# EAGLE design SOIC+TSSOP-20 300mil DIP (EAGLE 6.6.0)
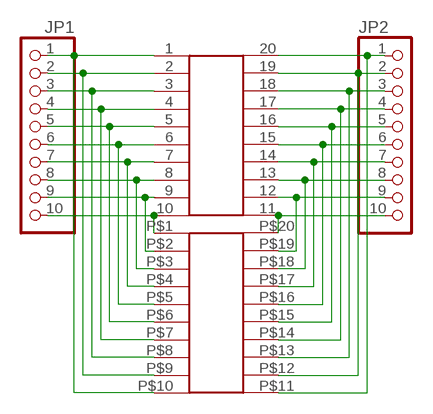
[diagram p0: schematic, sheet 1]

## Parts
JP1  PINHD-1X10  [1X10]
JP2  PINHD-1X10  [1X10]
U$1  SMD-20TSSOP  [TSSOP-20NM]
U$2  SMD-20SOIC  [SO-20NMW]

## Nets
N$1: JP1.1 U$1.1 U$2.P$10
N$2: JP1.2 U$1.2 U$2.P$9
N$3: JP1.3 U$1.3 U$2.P$8
N$4: JP1.4 U$1.4 U$2.P$7
N$5: JP1.5 U$1.5 U$2.P$6
N$6: JP1.6 U$1.6 U$2.P$5
N$7: JP1.7 U$1.7 U$2.P$4
N$8: JP1.8 U$1.8 U$2.P$3
N$9: JP1.9 U$1.9 U$2.P$2
N$10: JP1.10 U$1.10 U$2.P$1
N$11: JP2.1 U$1.20 U$2.P$11
N$12: JP2.2 U$1.19 U$2.P$12
N$13: JP2.3 U$1.18 U$2.P$13
N$14: JP2.5 U$1.16 U$2.P$15
N$15: JP2.4 U$1.17 U$2.P$14
N$16: JP2.6 U$1.15 U$2.P$16
N$17: JP2.7 U$1.14 U$2.P$17
N$18: JP2.8 U$1.13 U$2.P$18
N$19: JP2.9 U$1.12 U$2.P$19
N$20: JP2.10 U$1.11 U$2.P$20

## Library data of the parts
JP1 JP2 = pinhead:PINHD-1X10: PIN HEADER
U$1 U$2 = boogie:SMD-20

## Board
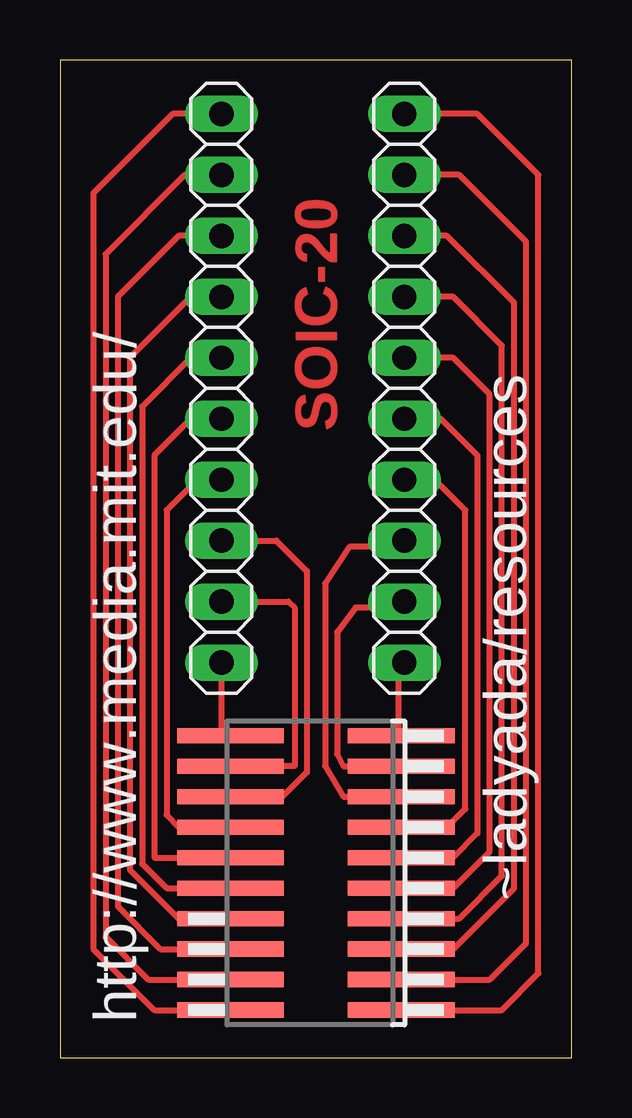
[diagram p1: board, top side]
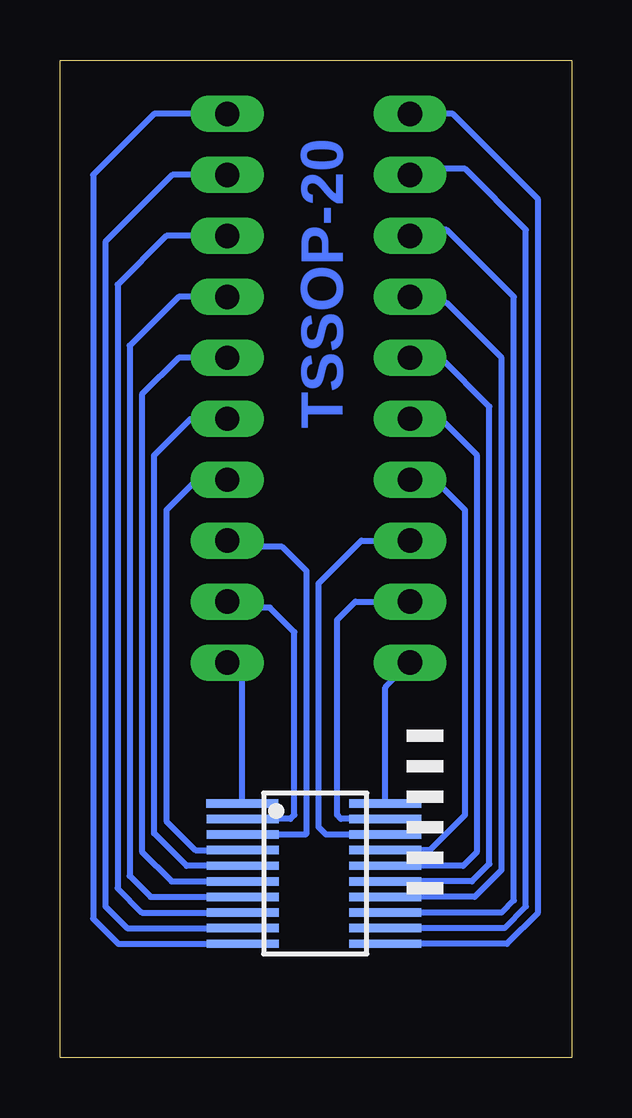
[diagram p2: board, bottom side, seen from below]

Size 21.32 x 41.58 mm. Coordinates in mm from the lower left corner, seen from the top.
Outline: 0,0 21.32,0 21.32,41.58 0,41.58 0,0
Copper layers (1*16): Top 0.035mm / dielectric 1.5mm / Bottom 0.035mm
Design rules "default": minimum track width 10mil, minimum drill 24mil, track to track 8mil, track to pad 8mil, pad to pad 8mil, via to via 8mil, smd to smd 8mil, copper to edge 40mil, drill to drill 8mil, minimum pad ring 10mil, minimum via ring 8mil, stop-mask expansion 4mil, vias tented up to drill 0mil, thermal gap 10mil

### Footprints (pad centres in the part's own frame; a part is rotated, then mirrored left to right if it is on the bottom)
1X10 = drill 1.016 long: 1 -11.43,0; 2 -8.89,0; 3 -6.35,0; 4 -3.81,0; 5 -1.27,0; 6 1.27,0; 7 3.81,0; 8 6.35,0; 9 8.89,0; 10 11.43,0
TSSOP-20NM = smd 0.35 x 3: 1 -1.745,-3.193; 2 -1.105,-3.169; 3 -0.455,-3.169; 4 0.195,-3.169; 5 0.845,-3.169; 6 1.495,-3.169; 7 2.145,-3.169; 8 2.795,-3.169; 9 3.445,-3.169; 10 4.095,-3.169; 11 4.095,2.781; 12 3.445,2.781; 13 2.795,2.781; 14 2.145,2.781; 15 1.495,2.781; 16 0.845,2.781; 17 0.195,2.781; 18 -0.455,2.781; 19 -1.105,2.781; 20 -1.755,2.781
SO-20NMW = smd 0.635 x 4.445: P$1 -4.318,-3.683; P$2 -3.048,-3.683; P$3 -1.778,-3.683; P$4 -0.508,-3.683; P$5 0.762,-3.683; P$6 2.032,-3.683; P$7 3.302,-3.683; P$8 4.572,-3.683; P$9 5.842,-3.683; P$10 7.112,-3.683; P$11 7.112,3.429; P$12 5.842,3.429; P$13 4.572,3.429; P$14 3.302,3.429; P$15 2.032,3.429; P$16 0.762,3.429; P$17 -0.508,3.429; P$18 -1.778,3.429; P$19 -3.048,3.429; P$20 -4.318,3.429

### Placement (x,y rotation side)
JP1  14.35,27.9 90 top
JP2  6.73,27.9 90 top
U$1  10.54,8.85 270 bottom
U$2  10.54,6.31 90 top

### Tracks (layer width: path | path; a pad name or v marks a point on that pad's centre or on a via)
N$1
  Top 0.254: U$2.P$10 14.09,13.42 14.09,16.47 JP1.1
  Bottom 0.254: U$1.1 13.73,15.86 JP1.1
N$2
  Top 0.254: U$2.P$9 11.81,12.15 11.55,12.66 11.55,17.74 12.31,18.76 14.09,18.76 JP1.2
  Bottom 0.254: U$1.2 11.72,9.96 11.55,10.12 11.55,17.74 12.57,18.76 14.35,18.76 JP1.2
N$3
  Top 0.254: U$2.P$8 11.81,10.88 11.04,12.15 11.04,19.77 12.06,21.3 14.09,21.3 JP1.3
  Bottom 0.254: U$1.3 11.1,9.31 11.04,9.36 11.04,20.28 12.06,21.3 14.35,21.3 14.6,21.55 JP1.3
N$4
  Top 0.254: U$2.P$7 16.12,9.61 16.89,10.38 16.89,22.82 15.62,24.09 JP1.4
  Bottom 0.254: U$1.4 15.67,8.66 16.89,9.87 16.89,22.82 15.62,24.09 JP1.4
N$5
  Top 0.254: U$2.P$6 16.38,8.34 17.39,9.36 17.39,25.11 15.87,26.63 JP1.5
  Bottom 0.254: U$1.5 16.04,8.01 17.39,9.36 17.39,25.11 15.87,26.63 JP1.5 14.09,26.63
N$6
  Top 0.254: U$2.P$5 16.38,7.07 17.9,8.6 17.9,27.65 16.38,29.17 JP1.6
  Bottom 0.254: U$1.6 16.66,7.36 17.9,8.6 17.9,27.65 16.38,29.17 JP1.6
N$7
  Top 0.254: U$2.P$4 16.63,5.8 18.41,7.58 18.41,29.68 16.38,31.71 JP1.7
  Bottom 0.254: U$1.7 17.54,6.71 18.41,7.58 18.41,29.68 16.38,31.71 JP1.7
N$8
  Top 0.254: U$2.P$3 16.38,4.53 18.92,7.07 18.92,31.46 16.12,34.25 JP1.8
  Bottom 0.254: U$1.8 17.9,6.06 18.92,7.07 18.92,32.22 16.89,34.25 JP1.8
N$9
  Top 0.254: U$2.P$2 17.9,3.26 19.43,4.79 19.43,34 16.63,36.79 JP1.9
  Bottom 0.254: U$1.9 18.52,5.41 19.43,6.31 19.43,34 16.63,36.79 14.6,36.79 14.35,36.54 JP1.9
N$10
  Top 0.254: U$2.P$1 18.41,1.99 19.93,3.52 19.93,36.79 17.39,39.33 JP1.10
  Bottom 0.254: U$1.10 18.89,4.76 19.93,5.8 19.93,36.79 17.39,39.33 JP1.10
N$11
  Top 0.254: U$2.P$11 6.73,13.42 JP2.1
  Bottom 0.254: U$1.20 7.75,15.44 JP2.1
N$12
  Top 0.254: U$2.P$12 9.77,12.15 9.77,18.76 9.52,19.01 JP2.2
  Bottom 0.254: U$1.19 9.61,9.96 9.77,10.12 9.77,18.25 9.01,19.01 JP2.2
N$13
  Top 0.254: U$2.P$13 9.27,10.88 10.28,11.9 10.28,20.28 9.01,21.55 JP2.3
  Bottom 0.254: U$1.18 10.23,9.31 10.54,9.61 10.54,19.77 8.76,21.55 JP2.3
N$14
  Top 0.254: U$2.P$15 3.93,8.34 3.93,25.11 5.46,26.63 JP2.5
  Bottom 0.254: U$1.16 4.52,8.01 3.93,8.6 3.93,25.11 5.46,26.63 JP2.5
N$15
  Top 0.254: U$2.P$14 4.95,9.61 4.44,10.12 4.44,22.82 5.71,24.09 JP2.4
  Bottom 0.254: U$1.17 5.91,8.66 4.44,10.12 4.44,22.82 5.71,24.09 JP2.4
N$16
  Top 0.254: U$2.P$16 4.44,7.07 3.42,8.09 3.42,27.14 5.46,29.17 JP2.6
  Bottom 0.254: U$1.15 4.16,7.36 3.42,8.09 3.42,27.14 5.46,29.17 6.47,29.17 6.73,29.43 JP2.6
N$17
  Top 0.254: U$2.P$17 4.95,5.8 2.92,7.84 2.92,29.17 5.46,31.71 JP2.7
  Bottom 0.254: U$1.14 4.04,6.71 2.92,7.84 2.92,29.17 5.2,31.46 6.47,31.46 JP2.7 6.98,31.97
N$18
  Top 0.254: U$2.P$18 4.19,4.53 2.41,6.31 2.41,31.71 4.95,34.25 6.47,34.25 6.73,34.51 JP2.8
  Bottom 0.254: U$1.13 2.92,6.06 2.41,6.57 2.41,31.71 5.2,34.51 6.47,34.51 JP2.8
N$19
  Top 0.254: U$2.P$19 3.68,3.26 1.9,5.04 1.9,33.49 5.2,36.79 JP2.9
  Bottom 0.254: U$1.12 2.8,5.41 1.9,6.31 1.9,34.51 4.44,37.05 6.47,37.05 JP2.9
N$20
  Top 0.254: U$2.P$20 3.93,1.99 1.39,4.53 1.39,36.03 4.69,39.33 JP2.10
  Bottom 0.254: U$1.11 2.69,4.76 1.39,6.06 1.39,35.78 4.95,39.33 JP2.10

### Text on the board
Top: SOIC-20
Bottom: TSSOP-20
tPlace: ~ladyada/resources | http://www.media.mit.edu/